# Altium schematic sheet FPGA_51_CAN_Receiver.SchDoc
size B; Organization: Altium Limited; Address1: L3, 12a Rodborough Rd; Address2: Frenchs Forest; Address3: NSW; Address4: Australia 2086
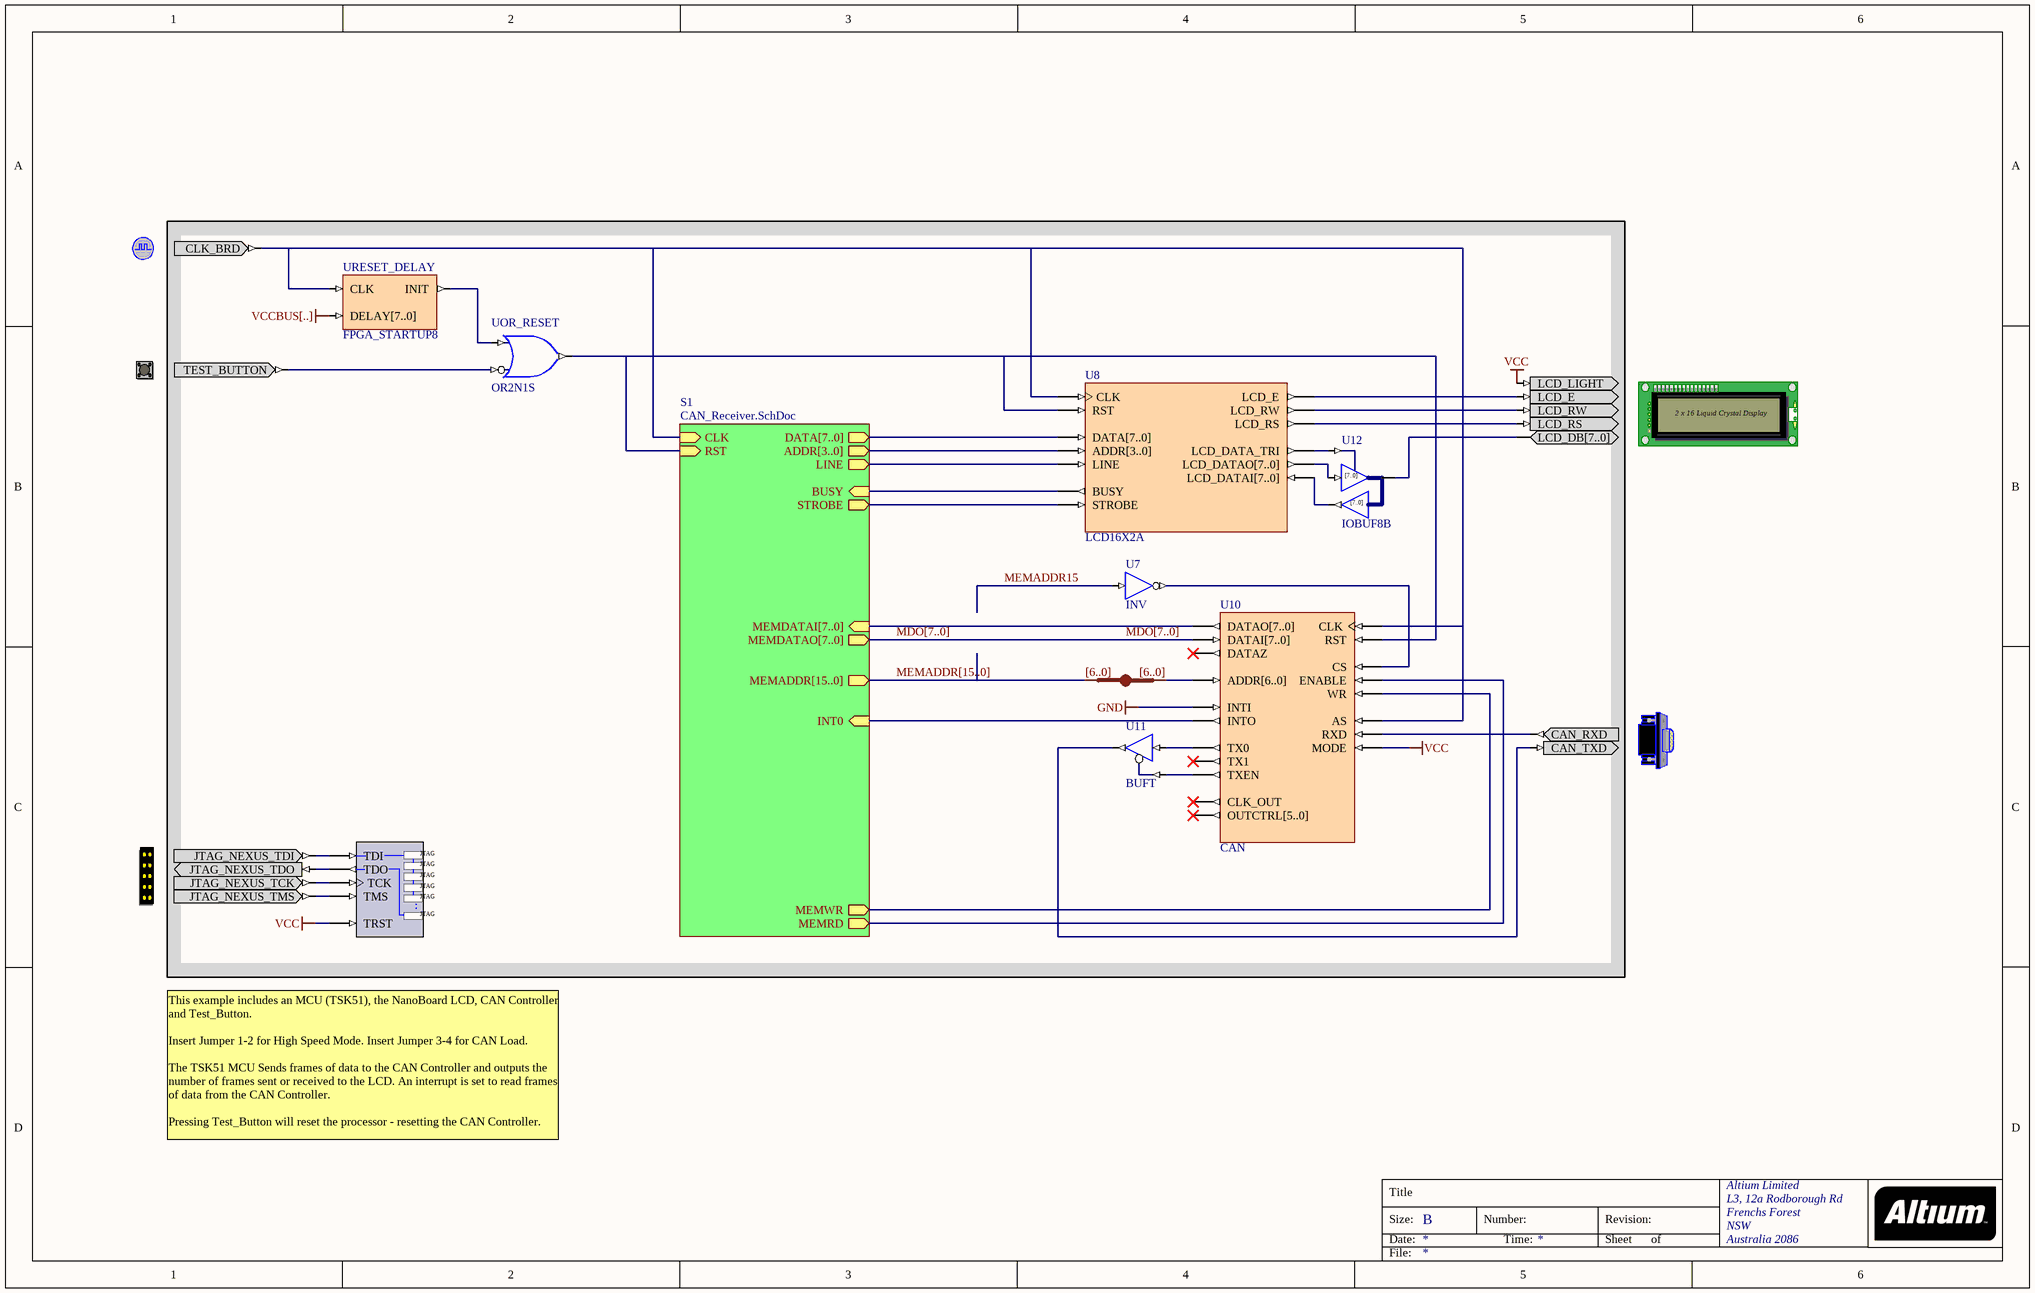
[diagram p0: FPGA_51_CAN_Receiver.SchDoc]

## Parts
(Parts that share a designator on the sheet are numbered #1, #2 ... from top to bottom, then left to right.)
?#1  CLOCK_BOARD  (value not drawn)
?#2  TEST_BUTTON  (value not drawn)
?#3  LCD  (value not drawn)
?#4  CANCNTR  (value not drawn)
?#5  NEXUS_JTAG_CONNECTOR  (value not drawn)
NEXUS_JTAG_PORT  NEXUS_JTAG_PORT  (value not drawn)
U5  IndexA: [6..0]  (hidden comment: JB)
U7  INV
U8  LCD16X2A
U10  CAN
U11  BUFT
U12  IOBUF8B
UOR_RESET  OR2N1S
URESET_DELAY  FPGA_STARTUP8

## Sub-sheets
S1 = CAN_Receiver.SchDoc: CLK (in), RST (in), BUSY (in), DATA[7..0] (out), MEMDATAO[7..0] (out), MEMDATAI[7..0] (in), MEMADDR[15..0] (out), MEMWR (out), MEMRD (out), INT0 (in), ADDR[3..0] (out), LINE (out), STROBE (out)

## Nets
GND: U10.INTI
VCC: ?#3.LCD_LIGHT NEXUS_JTAG_PORT.TRST U10.MODE
VCCBUS[..]: URESET_DELAY.DELAY[7..0]
MDO[7..0]: U10.DATAI[7..0] ; sheet S1/MEMDATAO[7..0]
MEMADDR15: U7.I
MEMADDR[15..0]: U5.A[0..0] ; sheet S1/MEMADDR[15..0]
Net?#1_CLK_BRD: ?#1.CLK_BRD U8.CLK U10.AS U10.CLK URESET_DELAY.CLK ; sheet S1/CLK
Net?#2_TEST_BUTTON: ?#2.TEST_BUTTON UOR_RESET.I0
Net?#3_LCD_DB[7..0]: ?#3.LCD_DB[7..0] U12.IO[7..0]
Net?#3_LCD_E: ?#3.LCD_E U8.LCD_E
Net?#3_LCD_RS: ?#3.LCD_RS U8.LCD_RS
Net?#3_LCD_RW: ?#3.LCD_RW U8.LCD_RW
Net?#4_CAN_RXD: ?#4.CAN_RXD U10.RXD
Net?#4_CAN_TXD: ?#4.CAN_TXD U11.O(Y)
Net?#5_JTAG_NEXUS_TCK: ?#5.JTAG_NEXUS_TCK NEXUS_JTAG_PORT.TCK
Net?#5_JTAG_NEXUS_TDI: ?#5.JTAG_NEXUS_TDI NEXUS_JTAG_PORT.TDI
Net?#5_JTAG_NEXUS_TDO: ?#5.JTAG_NEXUS_TDO NEXUS_JTAG_PORT.TDO
Net?#5_JTAG_NEXUS_TMS: ?#5.JTAG_NEXUS_TMS NEXUS_JTAG_PORT.TMS
NetU5_B[0..0]: U5.B[0..0] U10.ADDR[6..0]
NetU7_O: U7.O U10.CS
NetU8_ADDR[3..0]: U8.ADDR[3..0] ; sheet S1/ADDR[3..0]
NetU8_BUSY: U8.BUSY ; sheet S1/BUSY
NetU8_DATA[7..0]: U8.DATA[7..0] ; sheet S1/DATA[7..0]
NetU8_LCD_DATA_TRI: U8.LCD_DATA_TRI U12.T
NetU8_LCD_DATAI[7..0]: U8.LCD_DATAI[7..0] U12.O[7..0]
NetU8_LCD_DATAO[7..0]: U8.LCD_DATAO[7..0] U12.I[7..0]
NetU8_LINE: U8.LINE ; sheet S1/LINE
NetU8_RST: U8.RST U10.RST UOR_RESET.O ; sheet S1/RST
NetU8_STROBE: U8.STROBE ; sheet S1/STROBE
NetU10_DATAO[7..0]: U10.DATAO[7..0] ; sheet S1/MEMDATAI[7..0]
NetU10_ENABLE: U10.ENABLE ; sheet S1/MEMRD
NetU10_INTO: U10.INTO ; sheet S1/INT0
NetU10_TX0: U10.TX0 U11.I
NetU10_TXEN: U10.TXEN U11.T
NetU10_WR: U10.WR ; sheet S1/MEMWR
NetUOR_RESET_I1: UOR_RESET.I1 URESET_DELAY.INIT

Not connected (* = marked no-connect by the designer): U10 CLK_OUT* DATAZ* OUTCTRL[5..0]* TX1*

## Buses and harness runs
bus MDO[7..0] = sheet S1/MEMDATAO[7..0]
bus MEMADDR[15..0] = sheet S1/MEMADDR[15..0]

## Notes on the sheet
- This example includes an MCU (TSK51), the NanoBoard LCD, CAN Controller and Test_Button.
  Insert Jumper 1-2 for High Speed Mode. Insert Jumper 3-4 for CAN Load.
  The TSK51 MCU Sends frames of data to the CAN Controller and outputs the number of frames sent or received to the LCD. An interrupt is set to read frames of data from the CAN Controller.
  Pressing Test_Button will reset the processor - resetting the CAN Controller.
- Title
- Size:
- Date:
- B
- Number:
- Time:
- Revision:
- Sheet
- of
- File:
- (in symbol IOBUF8B) [7..0]
- (in symbol LCD) 2 x 16 Liquid Crystal Display
- (in symbol NEXUS_JTAG_PORT) JTAG; .

## Library data of the parts
?#1 = CLOCK_BOARD: Global System Clock Supply; PortComponent: True; Published: 19-Nov-2003; Publisher: Altium Limited
?#2 = TEST_BUTTON: Test Button; PortComponent: True; Published: 19-Nov-2003; Publisher: Altium Limited
?#3 = LCD: Liquid Crystal Display; PortComponent: True; Published: 19-Nov-2003; Publisher: Altium Limited
?#4 = CANCNTR: CAN Bus Connector; PortComponent: True; Published: 19-Nov-2003; Publisher: Altium Limited
?#5 = NEXUS_JTAG_CONNECTOR: JTAG Port; PortComponent: True; Published: 19-Nov-2003; Publisher: Altium Limited
NEXUS_JTAG_PORT = NEXUS_JTAG_PORT: Soft Nexus-Chain Connector; NEXUS_JTAG_CONNECTOR: True; Published: 18-Dec-2003; Publisher: Altium Limited
U5 = JB: System BUS Joiner; ArchiveName: GENERIC; Published: 18-Dec-2003; Publisher: Altium Limited; Core Revision: 1.00.00; IndexB: [6..0]
U7 = INV: Inverter; ArchiveName: GENERIC; Published: 18-Nov-2003; Publisher: Altium Limited; Xilinx Equivalent: INV; Core Revision: 1.00.00
U8 = LCD16X2A: LCD Controller; Published: 5/01/2004; Publisher: Altium Hobart Technology Centre; Core Revision: 1.00.00
U10 = CAN: CAN Controller; ChildModel1: CAN10000_DRAM8X64; Published: 18/12/2003; Publisher: Altium Hobart Technology Centre; Core Revision: 1.00.00
U11 = BUFT: 1-Bit 3-state Buffer with Active Low Enable; ArchiveName: GENERIC; Published: 18-Nov-2003; Publisher: Altium Limited; Xilinx Equivalent: BUFT; Core Revision: 1.00.00
U12 = IOBUF8B: 8-Bit Input/Output Buffer, Bus Version; ArchiveName: GENERIC; Published: 18-Dec-2003; Publisher: Altium Limited; Core Revision: 1.00.00
UOR_RESET = OR2N1S: 2-Input OR Gate with Active Low A Input, Single Pin Version; Xilinx Equivalent: OR2B1; ArchiveName: GENERIC; Published: 18-Dec-2003; Publisher: Altium Limited; Core Revision: 1.00.00
URESET_DELAY = FPGA_STARTUP8: FPGA Startup With 8 Bit Delay; Published: 21/01/2004; Publisher: Altium Hobart Technology Centre; Core Revision: 1.00.00